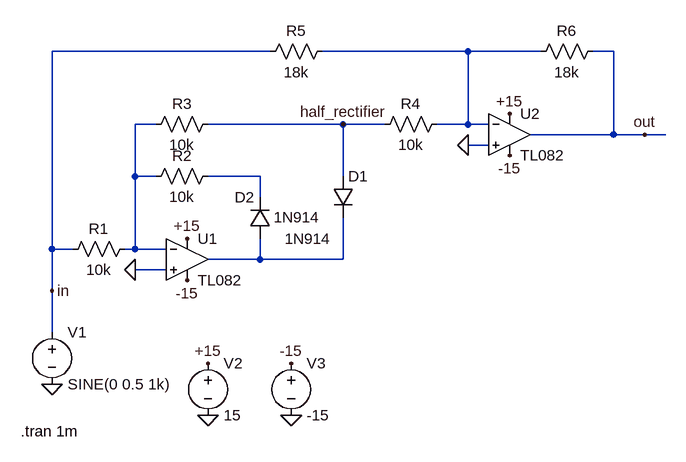
[diagram p0: schematic double_wave_rectifier.asc]
double_wave_rectifier.asc, the LTspice schematic file:
Version 4
SHEET 1 1080 680
WIRE 320 -224 -16 -224
WIRE 624 -224 400 -224
WIRE 736 -224 624 -224
WIRE 848 -224 816 -224
WIRE 144 -112 112 -112
WIRE 432 -112 224 -112
WIRE 496 -112 432 -112
WIRE 624 -112 624 -224
WIRE 624 -112 576 -112
WIRE 656 -112 624 -112
WIRE 848 -96 848 -224
WIRE 848 -96 720 -96
WIRE 896 -96 848 -96
WIRE 928 -96 896 -96
WIRE 656 -80 624 -80
WIRE 112 -32 112 -112
WIRE 144 -32 112 -32
WIRE 304 -32 224 -32
WIRE 432 -32 432 -112
WIRE 304 0 304 -32
WIRE -16 80 -16 -224
WIRE 16 80 -16 80
WIRE 112 80 112 -32
WIRE 112 80 96 80
WIRE 160 80 112 80
WIRE 304 96 304 64
WIRE 304 96 224 96
WIRE 432 96 432 32
WIRE 432 96 304 96
WIRE 160 112 112 112
WIRE -16 144 -16 80
WIRE -16 208 -16 144
FLAG 224 336 0
FLAG 352 336 0
FLAG 224 256 +15
FLAG 352 256 -15
FLAG -16 288 0
FLAG 112 112 0
FLAG 192 64 +15
FLAG 192 128 -15
FLAG 688 -128 +15
FLAG 688 -64 -15
FLAG 624 -80 0
FLAG 432 -112 half_rectifier
FLAG -16 144 in
FLAG 896 -96 out
SYMBOL voltage -16 192 R0
WINDOW 123 0 0 Left 0
WINDOW 39 0 0 Left 0
SYMATTR InstName V1
SYMATTR Value SINE(0 0.5 1k)
SYMBOL voltage 224 240 R0
WINDOW 123 0 0 Left 0
WINDOW 39 0 0 Left 0
SYMATTR InstName V2
SYMATTR Value 15
SYMBOL voltage 352 240 R0
WINDOW 123 0 0 Left 0
WINDOW 39 0 0 Left 0
SYMATTR InstName V3
SYMATTR Value -15
SYMBOL TL082 192 96 R0
SYMATTR InstName U1
SYMBOL res 112 64 R90
WINDOW 0 0 56 VBottom 2
WINDOW 3 32 56 VTop 2
SYMATTR InstName R1
SYMATTR Value 10k
SYMBOL res 240 -48 R90
WINDOW 0 0 56 VBottom 2
WINDOW 3 32 56 VTop 2
SYMATTR InstName R2
SYMATTR Value 10k
SYMBOL diode 416 -32 R0
WINDOW 3 -91 63 Left 2
SYMATTR Value 1N914
SYMATTR InstName D1
SYMBOL res 240 -128 R90
WINDOW 0 0 56 VBottom 2
WINDOW 3 32 56 VTop 2
SYMATTR InstName R3
SYMATTR Value 10k
SYMBOL diode 320 64 R180
WINDOW 0 24 64 Left 2
WINDOW 3 -93 0 Left 2
SYMATTR InstName D2
SYMATTR Value 1N914
SYMBOL TL082 688 -96 R0
SYMATTR InstName U2
SYMBOL res 592 -128 R90
WINDOW 0 0 56 VBottom 2
WINDOW 3 32 56 VTop 2
SYMATTR InstName R4
SYMATTR Value 10k
SYMBOL res 416 -240 R90
WINDOW 0 0 56 VBottom 2
WINDOW 3 32 56 VTop 2
SYMATTR InstName R5
SYMATTR Value 18k
SYMBOL res 832 -240 R90
WINDOW 0 0 56 VBottom 2
WINDOW 3 32 56 VTop 2
SYMATTR InstName R6
SYMATTR Value 18k
TEXT -64 360 Left 2 !.tran 1m

The netlist it stands for:
* double_wave_rectifier.asc
V1 in 0 SINE(0 0.5 1k)
V2 +15 0 15
V3 -15 0 -15
* U1: TL082 (symbol TL082 not available, pins judged from their places): In+=0 In-=N002 V+=+15 V-=-15 OUT=N004
R1 N002 in 10k
R2 N003 N002 10k
D1 half_rectifier N004 1N914
R3 half_rectifier N002 10k
D2 N004 N003 1N914
* U2: TL082 (symbol TL082 not available, pins judged from their places): In+=0 In-=N001 V+=+15 V-=-15 OUT=out
R4 N001 half_rectifier 10k
R5 N001 in 18k
R6 out N001 18k
.model D D
.lib standard.dio
.tran 1m
.backanno
.end